# Altium schematic sheet IMU_ACC.SchDoc
size A4
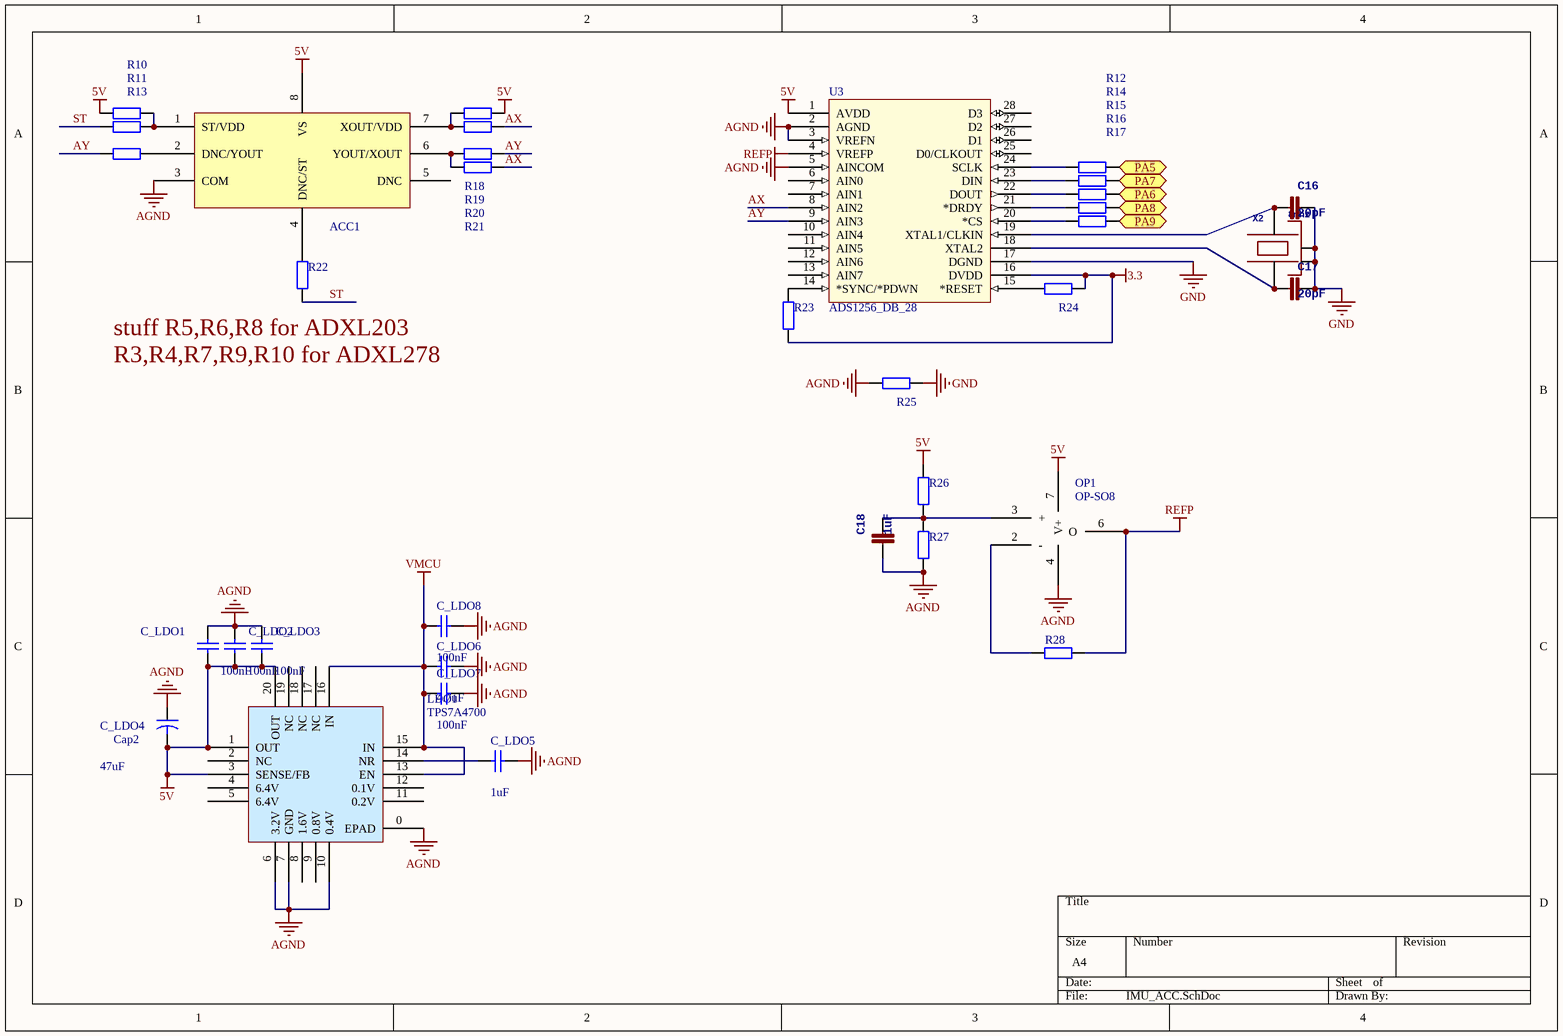
[diagram p0: IMU_ACC.SchDoc]

## Parts
ACC1  ACC-8  [ADXL203]  (value not drawn)
C16  20pF  [0402]
C17  20pF  [0402]
C18  1uF  [0603]
C_LDO1  value 100nF  [0603]
C_LDO2  value 100nF  [0603]
C_LDO3  value 100nF  [0603]
C_LDO4  Cap2  value 47uF  [1210]
C_LDO5  value 1uF  [0603]
C_LDO6  value 4.7uF  [0603]
C_LDO7  value 100nF  [0603]
C_LDO8  value 100nF  [1210]
LDO1  TPS7A4700  [TPS7A4700 - b]
OP1  OP-SO8  [D8]
R10  (no value)  [0402]
R11  (no value)  [0402]
R12  (no value)  [0402]
R13  (no value)  [0402]
R14  (no value)  [0402]
R15  (no value)  [0402]
R16  (no value)  [0402]
R17  (no value)  [0402]
R18  (no value)  [0402]
R19  (no value)  [0402]
R20  (no value)  [0402]
R21  (no value)  [0402]
R22  (no value)  [0402]
R23  (no value)  [0402]
R24  (no value)  [0402]
R25  (no value)  [0402]
R26  (no value)  [0603]
R27  (no value)  [0603]
R28  (no value)  [0402]
U3  ADS1256_DB_28  [DB28-L]
X2  8mhz  [OSCILLATOR-3.2X2.5]

## Ports
PA5, PA6, PA7, PA8, PA9

## Nets
3.3: R23.2 R24.2 U3.16(DVDD)
5V: ACC1.8(VS) C_LDO1.2 C_LDO2.2 C_LDO3.2 C_LDO4.2 LDO1.1(OUT) LDO1.3(SENSE/FB) LDO1.20(OUT) OP1.7(V+) R10.1 R18.2 R26.2 U3.1(AVDD)
AGND: ACC1.3(COM) C18.2 C_LDO1.1 C_LDO2.1 C_LDO3.1 C_LDO4.1 C_LDO5.1 C_LDO6.2 C_LDO7.2 C_LDO8.2 LDO1.0(EPAD) LDO1.6(3.2V) LDO1.7(GND) LDO1.10(0.4V) OP1.4 R25.1 R27.1 U3.2(AGND) U3.3(VREFN) U3.5(AINCOM)
GND: C16.1 C17.1 R25.2 U3.17(DGND) X2.2(NC_2) X2.4(NC_4)
REFP: OP1.6(O) R28.1 U3.4(VREFP)
VMCU: C_LDO6.1 C_LDO7.1 C_LDO8.1 LDO1.13(EN) LDO1.15(IN) LDO1.16(IN)
AX: R19.2 R21.2 U3.8(AIN2)
AY: R13.1 R20.2 U3.9(AIN3)
PA5: R12.2 ; port PA5
PA6: R15.2 ; port PA6
PA7: R14.2 ; port PA7
PA8: R16.2 ; port PA8
PA9: R17.2 ; port PA9
ST: R11.1 R22.1
NetACC1_1: ACC1.1(ST/VDD) R10.2 R11.2
NetACC1_2: ACC1.2(DNC/YOUT) R13.2
NetACC1_4: ACC1.4(DNC/ST) R22.2
NetACC1_6: ACC1.6(YOUT/XOUT) R20.1 R21.1
NetACC1_7: ACC1.7(XOUT/VDD) R18.1 R19.1
NetC16_2: C16.2 U3.19(XTAL1/CLKIN) X2.3
NetC17_2: C17.2 U3.18(XTAL2) X2.1
NetC18_1: C18.1 OP1.3(+) R26.1 R27.2
NetC_LDO5_2: C_LDO5.2 LDO1.14(NR)
NetOP1_2: OP1.2(-) R28.2
NetR12_1: R12.1 U3.24(SCLK)
NetR14_1: R14.1 U3.23(DIN)
NetR15_1: R15.1 U3.22(DOUT)
NetR16_1: R16.1 U3.21(*DRDY)
NetR17_1: R17.1 U3.20(*CS)
NetR23_1: R23.1 U3.14(*SYNC/*PDWN)
NetR24_1: R24.1 U3.15(*RESET)

Not connected (* = marked no-connect by the designer): ACC1 5(DNC); LDO1 2(NC) 4(6.4V) 5(6.4V) 8(1.6V) 9(0.8V) 11(0.2V) 12(0.1V) 17(NC) 18(NC) 19(NC); U3 6(AIN0) 7(AIN1) 10(AIN4) 11(AIN5) 12(AIN6) 13(AIN7) 25(D0/CLKOUT) 26(D1) 27(D2) 28(D3)

## Notes on the sheet
- (near R22) stuff R5,R6,R8 for ADXL203
- R3,R4,R7,R9,R10 for ADXL278

## Library data of the parts
ACC1 = ACC-8: Imported; RefDes: RefDes; Type: DEV; Value: Value
C16-C18 = CAP0402-CAP: 电容; PARTNO: CC0402ZRY5V7BB104
C_LDO1-C_LDO3 C_LDO5-C_LDO8 = Cap: Capacitor; Published: 8-Jun-2000; LatestRevisionDate: 17-Jul-2002; LatestRevisionNote: Re-released for DXP Platform.; PackageReference: RAD-0.3; Publisher: Altium Limited; PackageDescription: Radial Cap, Thru-Hole; 2 Leads; 0.3 in Pin Spacing
C_LDO4 = Cap2: Capacitor; Published: 23-Sep-2002; PackageReference: CAPR5-4X5; Publisher: Altium Limited; PackageDescription: Capacitor; 2 Leads
R10 R11 R13 R18-R22 R25-R28 = Res2: Resistor; Value: 0R; Published: 8-Jun-2000; LatestRevisionDate: 17-Jul-2002; LatestRevisionNote: Re-released for DXP Platform.; PackageReference: AXIAL-0.4; Publisher: Altium Limited; PackageDescription: Axial Device, Thru-Hole; 2 Leads; 0.4 in Pin Spacing
R12 R14-R17 R23 R24 = Res2: Resistor; Value: 200R; Published: 8-Jun-2000; LatestRevisionDate: 17-Jul-2002; LatestRevisionNote: Re-released for DXP Platform.; PackageReference: AXIAL-0.4; Publisher: Altium Limited; PackageDescription: Axial Device, Thru-Hole; 2 Leads; 0.4 in Pin Spacing
U3 = ADS1256_DB_28: Imported; Manufacturer: Texas Instruments; INDUSTRY_STD_PKG_TYPE: SSOP; FAMILY_NAME: PRECISION ADC (<=10MSPS); PIN_COUNT: 28; PACKAGE_DESIGNATOR: DB; Datasheet URL: http://www.ti.com/lit/gpn/ADS1256; GENERIC_PART_NUMBER: ADS1256; RefDes: RefDes; Type: DEV; Value: Value
X2 = OSCILLATOR-3.2X2.5: Crystal Oscillator in 3.2x2.5 SMD